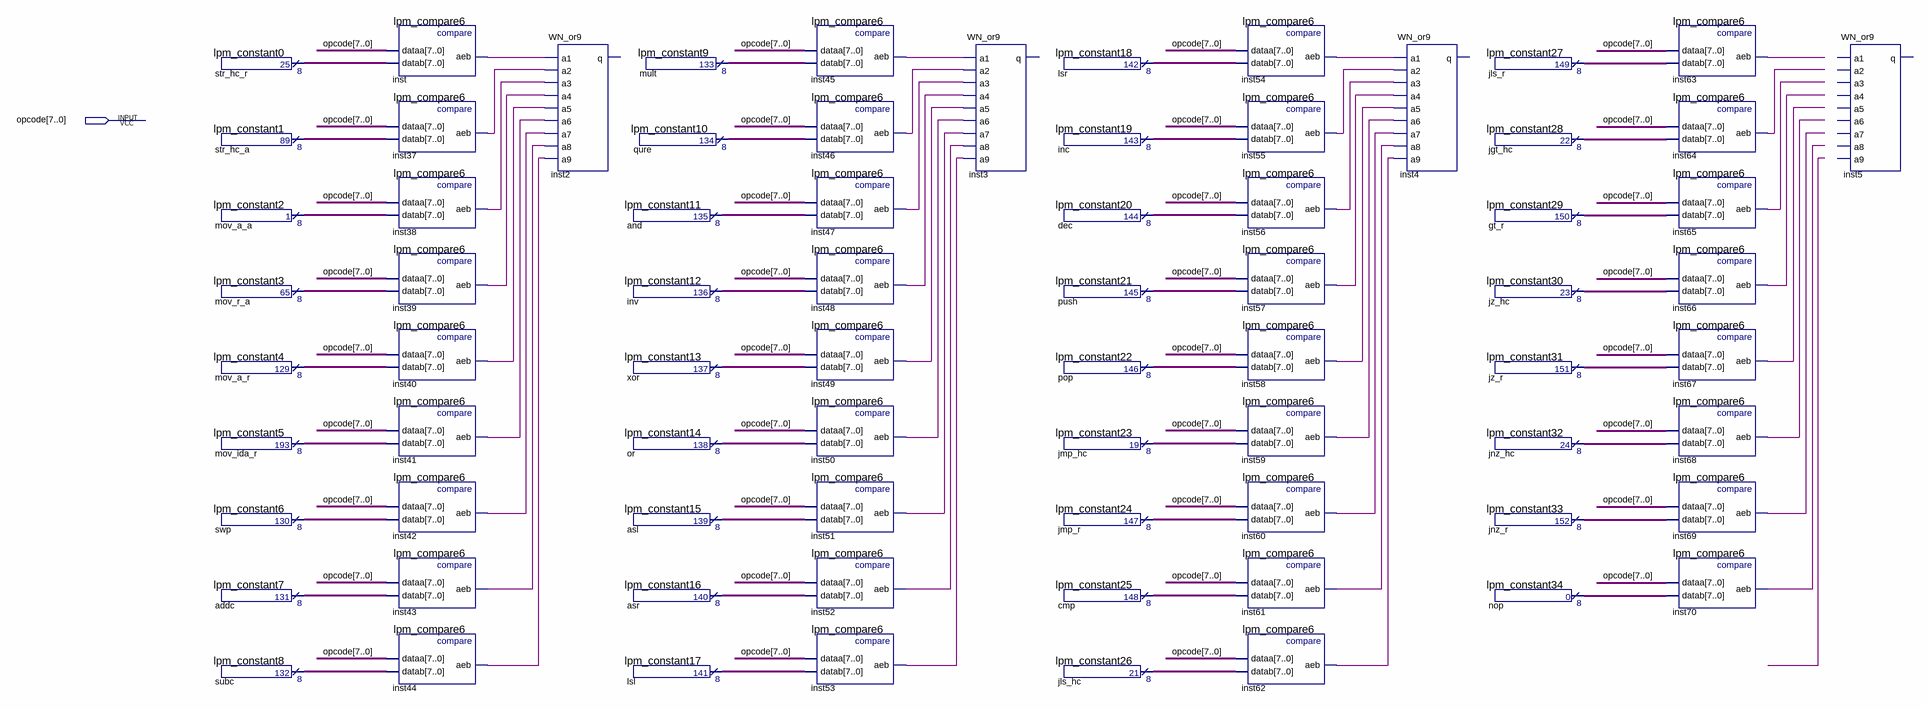
[diagram p0: schematic sheet]
// Quartus schematic WN_arity_dict.bdf as structural Verilog: 74 symbols, 1 pins
module WN_arity_dict (
  input  [7:0] opcode
);

  wire inst37_aeb, inst38_aeb, inst39_aeb, inst40_aeb, inst41_aeb, inst42_aeb, inst43_aeb, inst44_aeb,
       inst45_aeb, inst46_aeb, inst47_aeb, inst48_aeb, inst49_aeb, inst50_aeb, inst51_aeb, inst52_aeb,
       inst53_aeb, inst54_aeb, inst55_aeb, inst56_aeb, inst57_aeb, inst58_aeb, inst59_aeb, inst60_aeb,
       inst61_aeb, inst62_aeb, inst63_aeb, inst64_aeb, inst65_aeb, inst66_aeb, inst67_aeb, inst68_aeb,
       inst69_aeb, inst70_aeb, inst_aeb;
  wire [7:0] addc_result, and_result, asl_result, asr_result, cmp_result, dec_result, gt_r_result,
       inc_result, inv_result, jgt_hc_result, jls_hc_result, jls_r_result, jmp_hc_result, jmp_r_result,
       jnz_hc_result, jnz_r_result, jz_hc_result, jz_r_result, lsl_result, lsr_result, mov_a_a_result,
       mov_a_r_result, mov_ida_r_result, mov_r_a_result, mult_result, nop_result, or_result, pop_result,
       push_result, qure_result, str_hc_a_result, str_hc_r_result, subc_result, swp_result, xor_result;

  lpm_constant0 str_hc_r (.result(str_hc_r_result));
  lpm_constant1 str_hc_a (.result(str_hc_a_result));
  lpm_constant2 mov_a_a (.result(mov_a_a_result));
  lpm_constant3 mov_r_a (.result(mov_r_a_result));
  lpm_constant4 mov_a_r (.result(mov_a_r_result));
  lpm_constant5 mov_ida_r (.result(mov_ida_r_result));
  lpm_constant6 swp (.result(swp_result));
  lpm_constant7 addc (.result(addc_result));
  lpm_constant8 subc (.result(subc_result));
  lpm_compare6 inst (.dataa(opcode), .datab(str_hc_r_result), .aeb(inst_aeb));
  lpm_compare6 inst37 (.dataa(opcode), .datab(str_hc_a_result), .aeb(inst37_aeb));
  lpm_compare6 inst38 (.dataa(opcode), .datab(mov_a_a_result), .aeb(inst38_aeb));
  lpm_compare6 inst39 (.dataa(opcode), .datab(mov_r_a_result), .aeb(inst39_aeb));
  lpm_compare6 inst40 (.dataa(opcode), .datab(mov_a_r_result), .aeb(inst40_aeb));
  lpm_compare6 inst41 (.dataa(opcode), .datab(mov_ida_r_result), .aeb(inst41_aeb));
  lpm_compare6 inst42 (.dataa(opcode), .datab(swp_result), .aeb(inst42_aeb));
  lpm_compare6 inst43 (.dataa(opcode), .datab(addc_result), .aeb(inst43_aeb));
  lpm_compare6 inst44 (.dataa(opcode), .datab(subc_result), .aeb(inst44_aeb));
  WN_or9 inst2 (
    .a1(inst_aeb), .a2(inst37_aeb), .a3(inst38_aeb), .a4(inst39_aeb), .a5(inst40_aeb), .a6(inst41_aeb),
    .a7(inst42_aeb), .a8(inst43_aeb), .a9(inst44_aeb));  // open: q
  lpm_constant9 mult (.result(mult_result));
  lpm_constant10 qure (.result(qure_result));
  lpm_constant11 \and  (.result(and_result));
  lpm_constant12 inv (.result(inv_result));
  lpm_constant13 \xor  (.result(xor_result));
  lpm_constant14 \or  (.result(or_result));
  lpm_constant15 asl (.result(asl_result));
  lpm_constant16 asr (.result(asr_result));
  lpm_constant17 lsl (.result(lsl_result));
  lpm_compare6 inst45 (.dataa(opcode), .datab(mult_result), .aeb(inst45_aeb));
  lpm_compare6 inst46 (.dataa(opcode), .datab(qure_result), .aeb(inst46_aeb));
  lpm_compare6 inst47 (.dataa(opcode), .datab(and_result), .aeb(inst47_aeb));
  lpm_compare6 inst48 (.dataa(opcode), .datab(inv_result), .aeb(inst48_aeb));
  lpm_compare6 inst49 (.dataa(opcode), .datab(xor_result), .aeb(inst49_aeb));
  lpm_compare6 inst50 (.dataa(opcode), .datab(or_result), .aeb(inst50_aeb));
  lpm_compare6 inst51 (.dataa(opcode), .datab(asl_result), .aeb(inst51_aeb));
  lpm_compare6 inst52 (.dataa(opcode), .datab(asr_result), .aeb(inst52_aeb));
  lpm_compare6 inst53 (.dataa(opcode), .datab(lsl_result), .aeb(inst53_aeb));
  WN_or9 inst3 (
    .a1(inst45_aeb), .a2(inst46_aeb), .a3(inst47_aeb), .a4(inst48_aeb), .a5(inst49_aeb), .a6(inst50_aeb),
    .a7(inst51_aeb), .a8(inst52_aeb), .a9(inst53_aeb));  // open: q
  lpm_constant18 lsr (.result(lsr_result));
  lpm_constant19 inc (.result(inc_result));
  lpm_constant20 dec (.result(dec_result));
  lpm_constant21 push (.result(push_result));
  lpm_constant22 pop (.result(pop_result));
  lpm_constant23 jmp_hc (.result(jmp_hc_result));
  lpm_constant24 jmp_r (.result(jmp_r_result));
  lpm_constant25 cmp (.result(cmp_result));
  lpm_constant26 jls_hc (.result(jls_hc_result));
  lpm_compare6 inst54 (.dataa(opcode), .datab(lsr_result), .aeb(inst54_aeb));
  lpm_compare6 inst55 (.dataa(opcode), .datab(inc_result), .aeb(inst55_aeb));
  lpm_compare6 inst56 (.dataa(opcode), .datab(dec_result), .aeb(inst56_aeb));
  lpm_compare6 inst57 (.dataa(opcode), .datab(push_result), .aeb(inst57_aeb));
  lpm_compare6 inst58 (.dataa(opcode), .datab(pop_result), .aeb(inst58_aeb));
  lpm_compare6 inst59 (.dataa(opcode), .datab(jmp_hc_result), .aeb(inst59_aeb));
  lpm_compare6 inst60 (.dataa(opcode), .datab(jmp_r_result), .aeb(inst60_aeb));
  lpm_compare6 inst61 (.dataa(opcode), .datab(cmp_result), .aeb(inst61_aeb));
  lpm_compare6 inst62 (.dataa(opcode), .datab(jls_hc_result), .aeb(inst62_aeb));
  WN_or9 inst4 (
    .a1(inst54_aeb), .a2(inst55_aeb), .a3(inst56_aeb), .a4(inst57_aeb), .a5(inst58_aeb), .a6(inst59_aeb),
    .a7(inst60_aeb), .a8(inst61_aeb), .a9(inst62_aeb));  // open: q
  lpm_constant27 jls_r (.result(jls_r_result));
  lpm_constant28 jgt_hc (.result(jgt_hc_result));
  lpm_constant29 gt_r (.result(gt_r_result));
  lpm_constant30 jz_hc (.result(jz_hc_result));
  lpm_constant31 jz_r (.result(jz_r_result));
  lpm_constant32 jnz_hc (.result(jnz_hc_result));
  lpm_constant33 jnz_r (.result(jnz_r_result));
  lpm_constant34 nop (.result(nop_result));
  lpm_compare6 inst63 (.dataa(opcode), .datab(jls_r_result), .aeb(inst63_aeb));
  lpm_compare6 inst64 (.dataa(opcode), .datab(jgt_hc_result), .aeb(inst64_aeb));
  lpm_compare6 inst65 (.dataa(opcode), .datab(gt_r_result), .aeb(inst65_aeb));
  lpm_compare6 inst66 (.dataa(opcode), .datab(jz_hc_result), .aeb(inst66_aeb));
  lpm_compare6 inst67 (.dataa(opcode), .datab(jz_r_result), .aeb(inst67_aeb));
  lpm_compare6 inst68 (.dataa(opcode), .datab(jnz_hc_result), .aeb(inst68_aeb));
  lpm_compare6 inst69 (.dataa(opcode), .datab(jnz_r_result), .aeb(inst69_aeb));
  lpm_compare6 inst70 (.dataa(opcode), .datab(nop_result), .aeb(inst70_aeb));
  WN_or9 inst5 ();  // open: a1, a2, a3, a4, a5, a6, a7, a8, a9, q
endmodule
